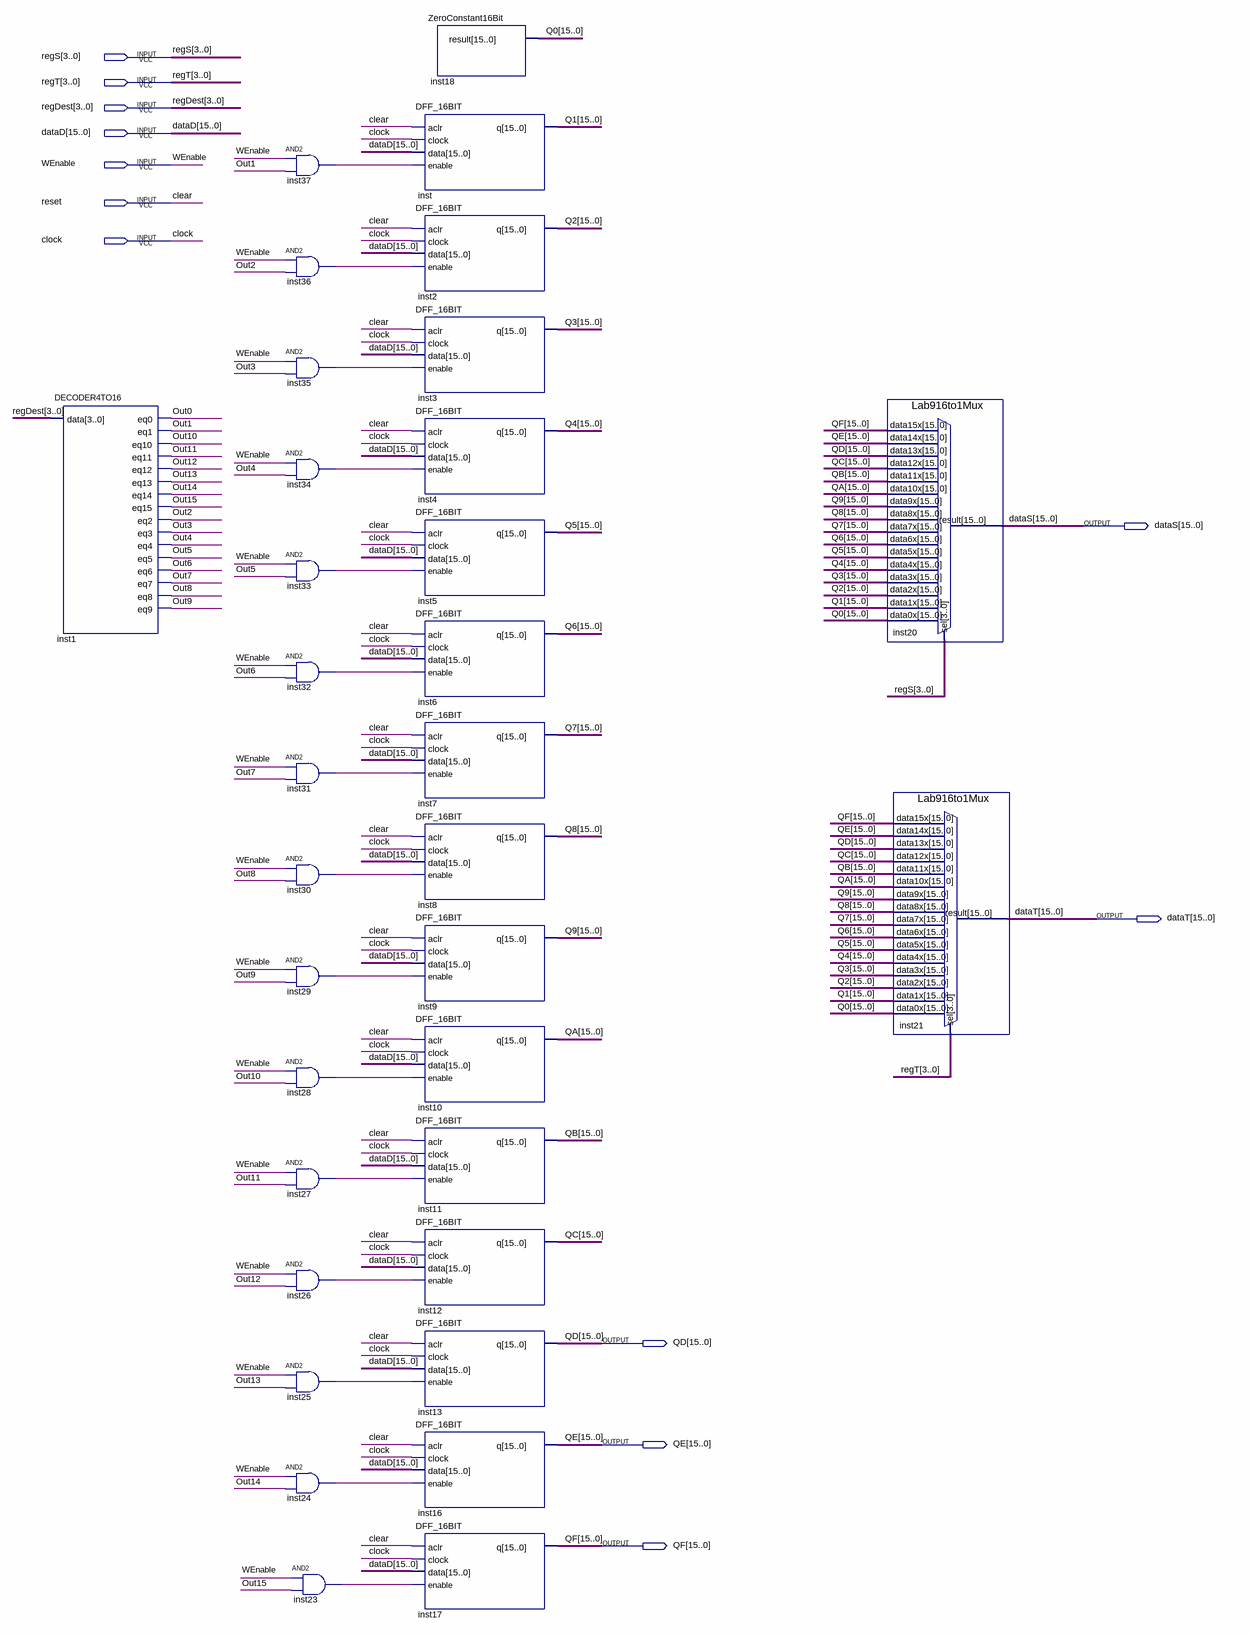
[diagram p0: schematic sheet]
// Quartus schematic smpRegisterFile.bdf as structural Verilog: 34 symbols, 12 pins
module smpRegisterFile (
  input  [3:0] regS,
  input  [3:0] regT,
  input  [3:0] regDest,
  input  [15:0] dataD,
  input  WEnable,
  input  reset,
  input  clock,
  output [15:0] dataS,
  output [15:0] dataT,
  output [15:0] QD,
  output [15:0] QE,
  output [15:0] QF
);

  wire inst23_out, inst24_out, inst25_out, inst26_out, inst27_out, inst28_out, inst29_out, inst30_out,
       inst31_out, inst32_out, inst33_out, inst34_out, inst35_out, inst36_out, inst37_out, Out0, Out1, Out2,
       Out3, Out4, Out5, Out6, Out7, Out8, Out9, Out10, Out11, Out12, Out13, Out14, Out15;
  wire [15:0] Q0, Q1, Q2, Q3, Q4, Q5, Q6, Q7, Q8, Q9, QA, QB, QC;

  DECODER4TO16 inst1 (
    .data(regDest), .eq0(Out0), .eq1(Out1), .eq10(Out10), .eq11(Out11), .eq12(Out12), .eq13(Out13),
    .eq14(Out14), .eq15(Out15), .eq2(Out2), .eq3(Out3), .eq4(Out4), .eq5(Out5), .eq6(Out6), .eq7(Out7),
    .eq8(Out8), .eq9(Out9));
  and inst37 (inst37_out, WEnable, Out1);
  and inst36 (inst36_out, WEnable, Out2);
  and inst35 (inst35_out, WEnable, Out3);
  and inst34 (inst34_out, WEnable, Out4);
  and inst33 (inst33_out, WEnable, Out5);
  and inst32 (inst32_out, WEnable, Out6);
  and inst31 (inst31_out, WEnable, Out7);
  and inst30 (inst30_out, WEnable, Out8);
  and inst29 (inst29_out, WEnable, Out9);
  and inst28 (inst28_out, WEnable, Out10);
  and inst27 (inst27_out, WEnable, Out11);
  and inst26 (inst26_out, WEnable, Out12);
  and inst25 (inst25_out, WEnable, Out13);
  and inst24 (inst24_out, WEnable, Out14);
  and inst23 (inst23_out, WEnable, Out15);
  DFF_16BIT inst (.aclr(reset), .clock(clock), .data(dataD), .enable(inst37_out), .q(Q1));
  DFF_16BIT inst2 (.aclr(reset), .clock(clock), .data(dataD), .enable(inst36_out), .q(Q2));
  DFF_16BIT inst3 (.aclr(reset), .clock(clock), .data(dataD), .enable(inst35_out), .q(Q3));
  DFF_16BIT inst4 (.aclr(reset), .clock(clock), .data(dataD), .enable(inst34_out), .q(Q4));
  DFF_16BIT inst5 (.aclr(reset), .clock(clock), .data(dataD), .enable(inst33_out), .q(Q5));
  DFF_16BIT inst6 (.aclr(reset), .clock(clock), .data(dataD), .enable(inst32_out), .q(Q6));
  DFF_16BIT inst7 (.aclr(reset), .clock(clock), .data(dataD), .enable(inst31_out), .q(Q7));
  DFF_16BIT inst8 (.aclr(reset), .clock(clock), .data(dataD), .enable(inst30_out), .q(Q8));
  DFF_16BIT inst9 (.aclr(reset), .clock(clock), .data(dataD), .enable(inst29_out), .q(Q9));
  DFF_16BIT inst10 (.aclr(reset), .clock(clock), .data(dataD), .enable(inst28_out), .q(QA));
  DFF_16BIT inst11 (.aclr(reset), .clock(clock), .data(dataD), .enable(inst27_out), .q(QB));
  DFF_16BIT inst12 (.aclr(reset), .clock(clock), .data(dataD), .enable(inst26_out), .q(QC));
  DFF_16BIT inst13 (.aclr(reset), .clock(clock), .data(dataD), .enable(inst25_out), .q(QD));
  DFF_16BIT inst16 (.aclr(reset), .clock(clock), .data(dataD), .enable(inst24_out), .q(QE));
  DFF_16BIT inst17 (.aclr(reset), .clock(clock), .data(dataD), .enable(inst23_out), .q(QF));
  ZeroConstant16Bit inst18 (.result(Q0));
  Lab916to1Mux inst20 (
    .data15x(QF), .data14x(QE), .data13x(QD), .data12x(QC), .data11x(QB), .data10x(QA), .data9x(Q9),
    .data8x(Q8), .data7x(Q7), .data6x(Q6), .data5x(Q5), .data4x(Q4), .data3x(Q3), .data2x(Q2), .data1x(Q1),
    .data0x(Q0), .sel(regS), .result(dataS));
  Lab916to1Mux inst21 (
    .data15x(QF), .data14x(QE), .data13x(QD), .data12x(QC), .data11x(QB), .data10x(QA), .data9x(Q9),
    .data8x(Q8), .data7x(Q7), .data6x(Q6), .data5x(Q5), .data4x(Q4), .data3x(Q3), .data2x(Q2), .data1x(Q1),
    .data0x(Q0), .sel(regT), .result(dataT));

  // Other names for the same wires on the sheet: clear = reset
endmodule
